# EasyEDA Pro project ProPrj_STM32F407核心板M.2_Vel1.0.epro, board PCB1
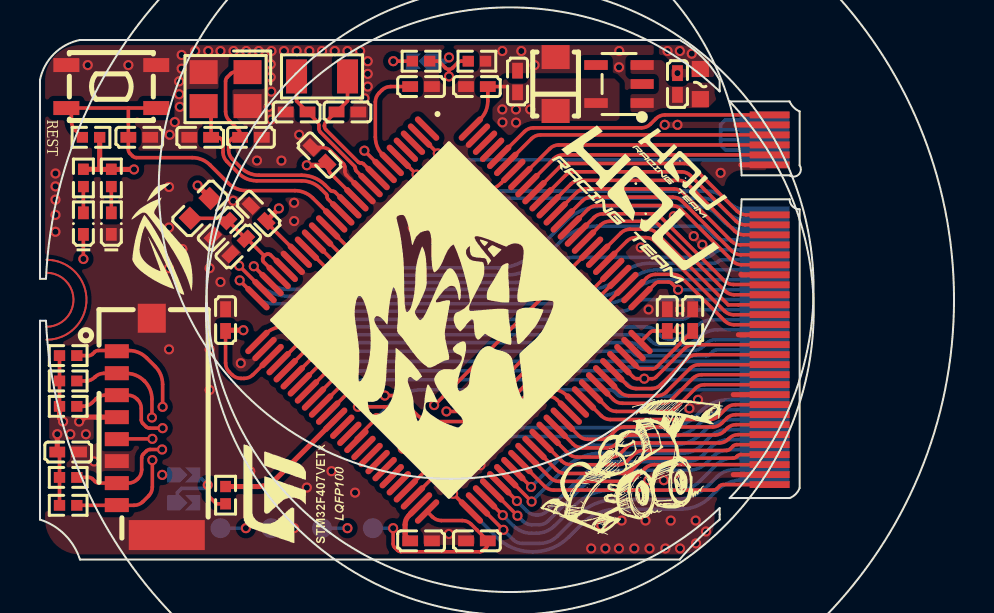
[diagram p1: board, top side]
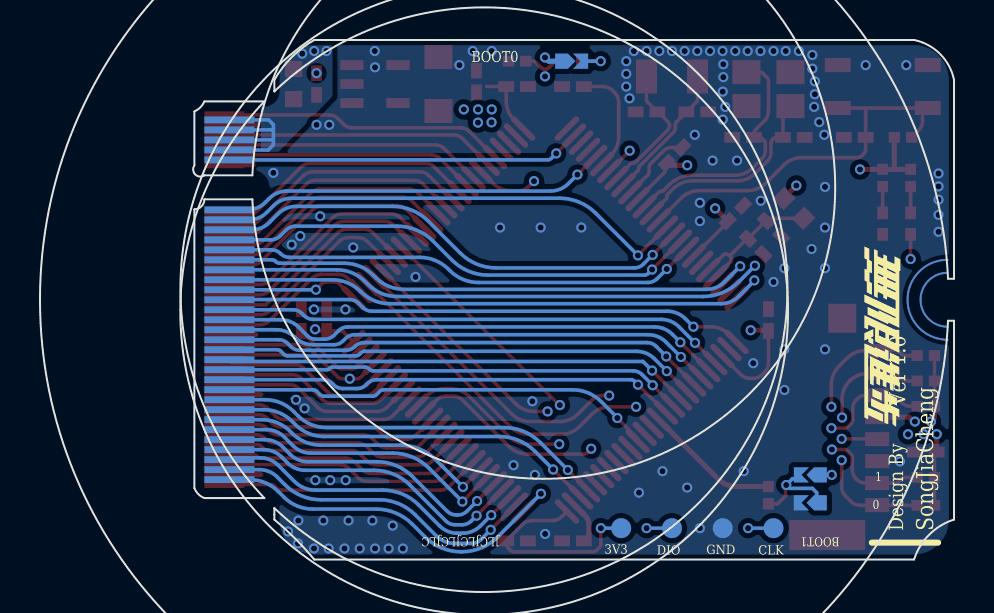
[diagram p2: board, bottom side, seen from below]

Outline 38 x 26 mm; copper layers: Top Layer, Inner1, Inner2, Bottom Layer. Coordinates in mm from the lower left corner of the outline.
Stack: Top Layer 0.035mm 外层铜厚1oz / Dielectric1 0.2104mm 7628 RC49% 8.6mil / Inner1 0.0152mm 内层铜厚 / Dielectric2 1.065mm 1.1mm H/HOZ Copper / Inner2 0.0152mm 内层铜厚 / Dielectric3 0.2104mm 7628 RC49% 8.6mil / Bottom Layer 0.035mm 外层铜厚1oz

## Design rules (mm)
template: 自定义配置
spacing copperThickness1oz (default): track to track 0.102, other pairs 0.152 to 0.3
spacing copperThickness2oz: track to track 0.203, other pairs 0.152 to 0.3
track width copperThickness1oz (default): min 0.127, default 0.152, max 2.54
track width copperThickness2oz: min 0.203, default 0.254, max 2.54
differential pair differentialPair (default): width min 0.127, default 0.254, max 2.54; gap min 0.152, default 0.152
via viaSize (default): diameter min 0.5, default 0.61, max 10; hole min 0.3, default 0.305, max 6.299

## Placement (name value [footprint] x y rotation side)
3V3  -  [Test-Point-0.5mm]  16.65 1.57 180 bottom
C1  100nF  [C0402]  9.28 11.98 90 top
C2  100nF  [C0402]  13.98 20.24 135 top
C3  100nF  [C0402]  10.94 17.32 135 top
C4  100nF  [C0402]  9.92 15.67 45 top
C6  100nF  [C0402]  4.97 21.13 0 top
C7  10pF  [C0402]  15.38 22.4 180 top
C8  10pF  [C0402]  12.84 22.4 0 top
C12  100nF  [C0402]  21.86 23.67 180 top
C13  100nF  [C0402]  31.38 11.98 90 top
C14  100nF  [C0402]  21.86 0.94 180 top
C15  10uF  [C0402]  9.03 16.56 45 top
C16  22pF  [C0402]  10.55 21.13 180 top
C17  22pF  [C0402]  8.01 21.13 0 top
C21  2.2uF  [C0402]  19.06 0.94 0 top
C22  2.2uF  [C0402]  32.65 11.98 90 top
C23  100nF  [C0402]  19.06 23.67 180 top
C24  100nF  [C0402]  1.41 5.38 180 top
C25  100nF  [C0402]  31.89 23.8 270 top
C26  100nF  [C0402]  23.89 23.92 270 top
C27  10uF  [CAP-SMD_L3.2-W1.6]  25.79 23.8 90 top
CARD1  TF-021B-H265  [TF-SMD_TF-021B-H265]  5.09 6.65 90 top
CLK  -  [Test-Point-0.5mm]  9.03 1.57 180 bottom
DIO  -  [Test-Point-0.5mm]  14.11 1.57 180 bottom
F1  BSMD0603-050-6V  [F0603]  33.03 23.8 270 top
GND  -  [Test-Point-0.5mm]  11.57 1.57 180 bottom
J1  -  [M.2.BKey.MALE.2230]  23 13 90 top
L1  CBG160808U121T  [L0603]  8.01 17.57 45 top
LED1  NCD0402G1  [LED0402-RD]  3.57 16.81 90 top
LED2  NCD0402G1  [LED0402-RD]  2.17 16.81 90 top
R2  10kΩ  [R0402]  2.55 21.13 0 top
R15  360Ω  [R0402]  19.06 24.94 180 top
R16  1.5kΩ  [R0402]  21.86 24.94 180 top
R18  1.5kΩ  [R0402]  9.28 3.22 270 top
R19  3kΩ  [R0402]  3.57 19.1 270 top
R20  360Ω  [R0402]  2.17 19.1 90 top
R21  10kΩ  [R0402]  1.41 4.11 180 top
R22  10kΩ  [R0402]  1.41 2.71 180 top
R23  10kΩ  [R0402]  1.41 10.21 180 top
R24  10kΩ  [R0402]  1.41 8.94 180 top
R25  10kΩ  [R0402]  1.41 7.67 180 top
SW1  TS-1089S-02526  [SW-SMD_4P-L4.2-W3.3-P2.15-LS5.1]  3.57 23.67 180 top
U11  STM32F407VET6  [LQFP-100_L14.0-W14.0-P0.50-LS16.0-BL]  20.46 11.98 225 top
U12  -  [JP_W1.6_H0.8]  19.95 24.56 180 bottom
U13  -  [JP_W1.6_H0.8]  6.36 4.62 0 bottom
U14  -  [JP_W1.6_H0.8]  6.36 3.22 0 bottom
U65  RT9013-33GB  [SOT-23-5_L3.0-W1.7-P0.95-LS2.8-BL]  28.97 23.8 90 top
X1  8MHz  [CRYSTAL-SMD_4P-L3.2-W2.5-BL]  9.28 23.54 180 top
X2  32.768kHz  [CRYSTAL-SMD_L3.2-W1.5-1]  14.11 24.18 180 top

## Footprints (pads in the part's own frame, mm; a bottom-side part is the same pattern mirrored in y, then rotated)
C0402
  rect 0.79x0.54 smd: 1(-0.545,0) 2(0.545,0)
CAP-SMD_L3.2-W1.6
  rect 1.2x1.4 smd: 1(-1.35,0) 2(1.35,0)
CRYSTAL-SMD_4P-L3.2-W2.5-BL
  rect 1.4x1.2 smd: 1(-1.1,-0.85) 2(1.1,-0.85) 3(1.1,0.85) 4(-1.1,0.85)
CRYSTAL-SMD_L3.2-W1.5-1
  rect 1.05x1.7 smd: 1(-1.275,0) 2(1.275,0)
F0603
  rect 0.806x0.864 smd: 1(-0.753,0) 2(0.753,0)
JP_W1.6_H0.8
  custom 1.016x0.762 smd: 1(0.508,0.381)
  custom 0.762x0.762 smd: 2(1.27,0.572)
  custom 0x0 smd: 4(1.232,-0.038)
L0603
  rect 0.8x0.864 smd: 1(-0.7,0) 2(0.7,0)
LED0402-RD
  rect 0.636x0.54 smd: 1(-0.538,0) 2(0.538,0)
LQFP-100_L14.0-W14.0-P0.50-LS16.0-BL
  oval 0.3x1.6 smd: 1(-6,-7.55) 2(-5.5,-7.55) 3(-5,-7.55) 4(-4.5,-7.55) 5(-4,-7.55) 6(-3.5,-7.55) 7(-3,-7.55) 8(-2.5,-7.55) 9(-2,-7.55) 10(-1.5,-7.55) 11(-1,-7.55) 12(-0.5,-7.55) 13(0,-7.55) 14(0.5,-7.55) 15(1,-7.55) 16(1.5,-7.55) 17(2,-7.55) 18(2.5,-7.55) 19(3,-7.55) 20(3.5,-7.55) 21(4,-7.55) 22(4.5,-7.55) 23(5,-7.55) 24(5.5,-7.55) 25(6,-7.55) 51(6,7.55) 52(5.5,7.55) 53(5,7.55) 54(4.5,7.55) 55(4,7.55) 56(3.5,7.55) 57(3,7.55) 58(2.5,7.55) 59(2,7.55) 60(1.5,7.55) 61(1,7.55) 62(0.5,7.55) 63(0,7.55) 64(-0.5,7.55) 65(-1,7.55) 66(-1.5,7.55) 67(-2,7.55) 68(-2.5,7.55) 69(-3,7.55) 70(-3.5,7.55) 71(-4,7.55) 72(-4.5,7.55) 73(-5,7.55) 74(-5.5,7.55) 75(-6,7.55)
  oval 1.6x0.3 smd: 26(7.55,-6) 27(7.55,-5.5) 28(7.55,-5) 29(7.55,-4.5) 30(7.55,-4) 31(7.55,-3.5) 32(7.55,-3) 33(7.55,-2.5) 34(7.55,-2) 35(7.55,-1.5) 36(7.55,-1) 37(7.55,-0.5) 38(7.55,0) 39(7.55,0.5) 40(7.55,1) 41(7.55,1.5) 42(7.55,2) 43(7.55,2.5) 44(7.55,3) 45(7.55,3.5) 46(7.55,4) 47(7.55,4.5) 48(7.55,5) 49(7.55,5.5) 50(7.55,6) 76(-7.55,6) 77(-7.55,5.5) 78(-7.55,5) 79(-7.55,4.5) 80(-7.55,4) 81(-7.55,3.5) 82(-7.55,3) 83(-7.55,2.5) 84(-7.55,2) 85(-7.55,1.5) 86(-7.55,1) 87(-7.55,0.5) 88(-7.55,0) 89(-7.55,-0.5) 90(-7.55,-1) 91(-7.55,-1.5) 92(-7.55,-2) 93(-7.55,-2.5) 94(-7.55,-3) 95(-7.55,-3.5) 96(-7.55,-4) 97(-7.55,-4.5) 98(-7.55,-5) 99(-7.55,-5.5) 100(-7.55,-6)
M.2.BKey.MALE.2230
  custom 0.34x2 smd: 1(9.25,-13.5) 3(8.75,-13.5) 5(8.25,-13.5) 7(7.75,-13.5) 9(7.25,-13.5) 11(6.75,-13.5) 21(4.25,-13.5) 23(3.75,-13.5) 25(3.25,-13.5) 27(2.75,-13.5) 29(2.25,-13.5) 31(1.75,-13.5) 33(1.25,-13.5) 35(0.75,-13.5) 37(0.25,-13.5) 39(-0.25,-13.5) 41(-0.75,-13.5) 43(-1.25,-13.5) 45(-1.75,-13.5) 47(-2.25,-13.5) 49(-2.75,-13.5) 51(-3.25,-13.5) 53(-3.75,-13.5) 55(-4.25,-13.5) 57(-4.75,-13.5) 59(-5.25,-13.5) 61(-5.75,-13.5) 63(-6.25,-13.5) 65(-6.75,-13.5) 67(-7.25,-13.5) 69(-7.75,-13.5) 71(-8.25,-13.5) 73(-8.75,-13.5) 75(-9.25,-13.5)
  custom 0.34x2.5 smd far side: 2(9,-13.25) 4(8.5,-13.25) 6(8,-13.25) 8(7.5,-13.25) 10(7,-13.25) 20(4.5,-13.25) 22(4,-13.25) 24(3.5,-13.25) 26(3,-13.25) 28(2.5,-13.25) 30(2,-13.25) 32(1.5,-13.25) 34(1,-13.25) 36(0.5,-13.25) 38(0,-13.25) 40(-0.5,-13.25) 42(-1,-13.25) 44(-1.5,-13.25) 46(-2,-13.25) 48(-2.5,-13.25) 50(-3,-13.25) 52(-3.5,-13.25) 54(-4,-13.25) 56(-4.5,-13.25) 58(-5,-13.25) 60(-5.5,-13.25) 62(-6,-13.25) 64(-6.5,-13.25) 66(-7,-13.25) 68(-7.5,-13.25) 70(-8,-13.25) 72(-8.5,-13.25) 74(-9,-13.25)
  custom 4x2.001 smd: 76(0,21)
  custom 4x2.001 smd far side: 77(0,21)
R0402
  rect 0.566x0.54 smd: 1(-0.433,0) 2(0.433,0)
SOT-23-5_L3.0-W1.7-P0.95-LS2.8-BL
  rect 0.49x1.157 smd: 1(-0.95,-1.153) 2(0,-1.153) 3(0.95,-1.153)
  rect 0.49x1.175 smd: 4(0.95,1.153) 5(-0.95,1.153)
SW-SMD_4P-L4.2-W3.3-P2.15-LS5.1
  rect 1.3x0.7 smd: 1(-2.25,1.075) 2(2.25,1.075) 3(-2.25,-1.075) 4(2.25,-1.075)
Test-Point-0.5mm
  round 1 smd: 1(0,0)
TF-SMD_TF-021B-H265
  rect 0.7x1.2 smd: 1(3.775,1.25) 2(2.675,1.25) 3(1.575,1.25) 4(0.475,1.25) 5(-0.625,1.25) 6(-1.725,1.25) 7(-2.825,1.25) 8(-3.925,1.25)
  rect 1.5x3.8 smd: 9(-5.425,-1.25)
  rect 1.45x1.4 smd: 10(5.425,-0.5)

## Nets
As in the schematic.

Pads without a net: J1 76 77; U11 1 3 4 38 39 41 42 43 44 45 46 97 98; U12 4; U13 4; U14 4; U65 4

## Via types
v1: diameter 0.508, hole 0.305, Top Layer to Bottom Layer, 173 vias

## Routing (per net, layer and track width the routed paths; a pad name or vN(x,y) marks a point on that pad's centre or on a via; arc(x,y) is an arc through that point)
3V3: length 142.6
  Top Layer w0.178: 23.38,23.67 C12.1 22.4,22.94 arc(22.31,22.45) 22.03,22.04 21.56,21.56 ; v1(31.96,11.52) 31.88,11.44 C13.1 30.7,11.44 arc(30.6,11.42) 30.52,11.36 30.04,10.89 ; C1.1 9.28,9.83 arc(9.33,9.59) 9.47,9.39 9.61,9.25 arc(9.81,9.11) 10.06,9.06 10.21,9.06 arc(10.45,9.11) 10.65,9.25 U11.28 ; U11.19 11.32,16.88 C3.1 ; C24.2 0.98,5.27 R21.2 R22.2 ; 21.85,1.49 21.85,1.49 ; 21.85,1.49 C14.1 22.4,0.78 arc(22.38,0.69) 22.33,0.61 22.19,0.46 arc(22.1,0.41) 22.01,0.39 18.06,0.39 arc(17.97,0.41) 17.88,0.46 17.74,0.61 arc(17.69,0.69) 17.67,0.79 v1(17.67,1.57) ; 21.85,1.49 21.57,1.77 arc(21.37,1.9) 21.12,1.95 20.08,1.95 arc(19.84,2) 19.63,2.14 19.36,2.4 ; R25.2 R24.2 R23.2 ; 14.43,19.71 14.43,19.53 arc(14.45,19.43) 14.51,19.35 U11.11
  Top Layer w0.254: CARD1.4 2.25,7.12 2.03,6.9 v1(1.96,6.9) ; 8.51,18.07 8.51,18.09 v1(7.89,18.72) ; v1(0.87,6.27) C24.2 ; 2.97,19.52 2.7,19.52 2.7,19.53 2.17,19.53 ; 2.97,19.52 v1(4.7,19.52) ; 2.97,19.52 2.99,19.54 R2.2 ; v1(1.16,6.9) 0.98,7.08 R25.2 ; v1(13.35,19.73) 14.25,19.73 C2.1 ; C3.1 11.32,16.94 v1(11.95,17.57) ; C1.1 9.32,11.48 v1(10.17,11.48)
  Inner1 w0.178: v1(6.12,4.24) 6.12,0.56 6.12,0.55
  Inner1 w0.254: v1(31.96,11.52) 24.98,11.52 22.87,13.64 ; 7.81,12.75 7.89,12.83 v1(7.89,18.72) ; v1(13.35,19.73) 13.35,13.13 ; v1(11.95,17.57) 11.95,13.13 ; v1(10.17,11.48) 10.17,12.49 ; v1(4.7,19.52) 4.7,13.13 ; v1(23.13,22.53) 23.06,22.53 v1(20.46,25.13)
  Inner1 w0.305: v1(17.67,1.57) 17.67,0.94 17.28,0.55 2.83,0.55 arc(2.34,0.65) 1.93,0.93 1.78,1.07 arc(1.51,1.48) 1.41,1.97 1.41,6.17 v1(1.52,6.27)
  Inner1 w0.508: v1(1.96,6.9) 3.59,8.53 arc(4.14,9.36) 4.33,10.33 4.33,12.11 arc(4.52,12.56) 4.97,12.75
  Inner1 w1.27: v1(23.81,22.53) 23.81,16.01 arc(23.62,15.03) 23.07,14.21 22.35,13.49 arc(21.52,12.94) 20.55,12.75 4.97,12.75
  Bottom Layer w0.178: v1(6.12,4.24) U13.1 ; v1(17.67,1.57) 3V3.1
  Bottom Layer w0.254: v1(20.46,25.13) 20.27,24.94 U12.1
  vias: v1(2.3,6.27) v1(23.14,21.88) v1(23.81,21.86) v1(24.52,22.53)
GND: length 13.5
  Top Layer w0.178: U11.10 15.33,19.24 arc(15.27,19.32) 15.25,19.42 15.25,19.63 arc(15.23,19.72) 15.18,19.81 14.55,20.44 arc(14.34,20.58) 14.1,20.62 C2.2
  Top Layer w0.254: J1.33 35.09,14.25 35.06,14.27 ; J1.11 35.06,19.75 ; J1.3 34.81,21.75 ; J1.45 34.94,11.25 ; J1.73 34.68,4.25 ; J1.57 34.68,8.25
  vias: v1(0.78,19.32) v1(0.78,18.67) v1(0.78,18.01) v1(0.78,17.25) v1(0.78,16.4) v1(2.39,24.74) v1(2.71,4.91) v1(4.42,24.74) v1(6.49,21.25) v1(6.45,18.65) v1(6.45,16.61) v1(6.45,14.58) v1(6.45,10.52) v1(6.74,21.89) v1(6.96,23.93) v1(6.96,23.28) v1(7,22.65) v1(7.09,25.25) v1(7.09,24.56) v1(7.12,15.54) v1(7.76,25.45) v1(8.42,25.45) v1(8.49,14.58) v1(8.49,10.52) v1(8.49,8.49) v1(9.03,25.45) v1(9.03,13.89) v1(9.68,25.45) v1(9.67,17.95) v1(10.05,9.83) v1(10.32,25.45) v1(10.52,4.42) v1(10.85,19.96) v1(10.94,25.45) v1(11.44,22.65) v1(11.58,25.45) v1(11.54,24.78) v1(11.54,24.14) v1(11.57,23.41) v1(11.57,22.02) v1(12.08,19.96) v1(12.21,25.45) v1(12.71,17.85) v1(12.71,16.94) v1(12.71,1.57) v1(12.84,25.45) v1(12.97,21.25) v1(13.35,3.6) v1(13.47,25.45) v1(14.11,25.45) v1(14.58,4.42) v1(14.75,25.45) v1(15.38,25.45) v1(15.76,3.35) v1(16.02,25.45) v1(16.23,23.08) v1(16.4,24.94) v1(16.4,24.3) v1(16.4,23.67) v1(18.65,16.61) v1(20.46,1.28) v1(20.68,16.61) v1(20.97,4.24) v1(21.09,7.92) v1(22.03,4.72) v1(22.71,16.61) v1(23.13,25.45) v1(24.08,25.45) v1(24.74,24.74) v1(26.94,14.14) v1(27.57,0.55) v1(28.08,1.7) v1(28.28,0.55) v1(28.98,25.45) v1(28.97,24.63) v1(28.96,0.55) v1(29.1,1.95) v1(29.73,0.55) v1(30.05,15.62) v1(30.29,1.95) v1(30.44,12.51) v1(30.43,3.97) v1(30.49,0.55) v1(31.21,3.97) v1(31.25,21.75) v1(31.29,0.55) v1(31.55,1.95) v1(31.71,17.18) v1(31.89,24.34) v1(31.89,21.75) v1(31.95,3.97) v1(32.02,12.51) v1(32.02,0.55) v1(32.49,7.56) v1(32.7,16.18) v1(32.8,1.95) v1(32.82,0.81) v1(32.92,7.99) v1(33.13,15.75) v1(33.32,1.4) v1(34.05,19.35)
VDDA: length 7.2
  Top Layer w0.178: 10.34,16.05 10.36,16.05 11.2,15.22 ; 7.52,17.08 9.23,17.08 arc(9.28,17.07) 9.32,17.04 C15.2 C4.2 ; U11.21 12.28,14.49 11.53,15.25 arc(11.49,15.27) 11.44,15.28 11.37,15.28 arc(11.32,15.28) 11.28,15.25 11.18,15.15 arc(11.15,15.11) 11.14,15.06 11.14,14.99 arc(11.15,14.94) 11.18,14.9 U11.22
BOOT0: length 11.1
  Top Layer w0.178: 20.46,24.42 v1(20.46,24.18) ; R15.1 19.84,24.94 arc(19.94,24.92) 20.02,24.86 20.28,24.6 arc(20.46,24.53) 20.64,24.6 20.9,24.86 arc(20.98,24.92) 21.08,24.94 R16.2 ; v1(21.01,18.94) 21.3,18.65 arc(21.51,18.51) 21.75,18.46 22.17,18.46 arc(22.65,18.56) 23.07,18.83 U11.94
  Inner1 w0.178: v1(20.46,24.18) 20.46,19.48 v1(21.01,18.94)
BOOT1: length 6.8
  Top Layer w0.254: 14.77,7 11.8,4.03 arc(11.38,3.75) 10.9,3.65 R18.1
M2_IN_+5V: length 10.1
  Bottom Layer w0.178: 34.05,21.55 34.1,21.5 J1.4 ; 34.05,21.55 34.05,21.02 ; 34.05,21.55 34.05,21.76 34.29,22 J1.2 ; J1.8 36.24,20.49 34.3,20.49 34.05,20.75 34.05,21.02 ; 34.05,21.02 34.07,21 J1.6
  vias: v1(31.39,25.45) v1(32.01,25.45) v1(32.6,25.31)
NRST: length 19.9
  Top Layer w0.178: R2.1 1.76,21.49 arc(1.62,21.69) 1.57,21.94 1.57,22.59 4.42,22.59 ; 4.42,22.59 C6.1 4.42,20.51 arc(4.44,20.41) 4.5,20.33 4.64,20.19 arc(4.72,20.13) 4.82,20.11 7.62,20.11 arc(8.1,20.02) 8.51,19.74 9.42,18.83 arc(9.83,18.56) 10.32,18.46 12.75,18.46 arc(13.24,18.36) 13.65,18.09 14.77,16.97 ; 4.42,22.59 6.07,22.59
OSC32_IN: length 6.7
  Top Layer w0.178: U11.8 16.17,19.81 arc(16.13,19.83) 16.08,19.84 16.02,19.84 arc(15.97,19.85) 15.93,19.88 14.31,21.51 arc(14.25,21.59) 14.23,21.69 14.23,21.72 arc(14.25,21.82) 14.31,21.9 14.8,22.4 C7.2 15.39,22.95 X2.1
OSC32_OUT: length 6.9
  Top Layer w0.178: X2.2 12.84,22.95 C8.2 13.88,21.91 arc(13.93,21.82) 13.95,21.73 13.95,21.57 arc(13.97,21.47) 14.03,21.39 15.74,19.68 arc(15.77,19.64) 15.78,19.59 15.78,19.55 arc(15.79,19.5) 15.82,19.46 U11.9
OSC_IN: length 12.7
  Top Layer w0.178: 10.38,24.39 9.73,24.39 arc(9.63,24.37) 9.55,24.32 9.36,24.12 arc(9.3,24.04) 9.28,23.94 9.28,22.41 arc(9.33,22.17) 9.47,21.96 9.93,21.5 arc(9.99,21.42) 10.01,21.32 C16.2 9.77,21.13 arc(9.67,21.11) 9.59,21.05 9.51,20.97 arc(9.46,20.89) 9.44,20.79 9.44,20.49 arc(9.48,20.25) 9.62,20.04 10.06,19.6 arc(10.47,19.33) 10.96,19.23 13.09,19.23 arc(13.72,19.11) 14.25,18.75 14.54,18.46 arc(14.58,18.44) 14.63,18.43 14.67,18.43 arc(14.72,18.42) 14.76,18.39 15.47,17.68
OSC_OUT: length 10.2
  Top Layer w0.178: U11.13 14.4,18.04 arc(14.38,18.08) 14.37,18.13 14.37,18.19 arc(14.36,18.23) 14.33,18.28 14.06,18.55 arc(13.61,18.85) 13.08,18.95 10.84,18.95 arc(10.36,19.05) 9.95,19.32 9.34,19.93 arc(9.21,20.13) 9.16,20.38 9.16,20.84 arc(9.14,20.94) 9.08,21.02 9.05,21.05 arc(8.97,21.11) 8.87,21.13 8.69,21.13 arc(8.6,21.17) 8.56,21.25 8.56,22.05 arc(8.51,22.3) 8.37,22.5 X1.3
PA0: length 27.7
  Top Layer w0.178: v1(10.7,14.68) U11.23
  Bottom Layer w0.178: v1(10.7,14.68) 11.48,13.89 arc(11.89,13.62) 12.38,13.52 27.5,13.52 arc(28.28,13.67) 28.94,14.12 29.06,14.23 arc(29.72,14.67) 30.5,14.83 33.74,14.83 arc(33.84,14.85) 33.92,14.9 33.94,14.93 arc(34.02,14.98) 34.12,15 J1.30
PA1: length 29
  Top Layer w0.178: v1(9.96,14.7) U11.24
  Bottom Layer w0.178: 36.25,14.5 30.89,14.5 arc(30.11,14.35) 29.45,13.91 29.3,13.76 arc(28.64,13.32) 27.87,13.16 12.56,13.16 arc(11.58,13.36) 10.76,13.91 v1(9.96,14.7)
PA2: length 28.3
  Top Layer w0.178: 10.88,13.08 v1(9.99,13.97)
  Bottom Layer w0.178: v1(9.99,13.97) 9.99,13.94 10.76,13.17 arc(11.17,12.9) 11.66,12.8 28.23,12.8 arc(29.01,12.96) 29.67,13.4 29.68,13.41 arc(30.33,13.85) 31.11,14 J1.34
PA3: length 26.1
  Top Layer w0.178: v1(13.04,11.65) 12.17,11.65 arc(11.68,11.55) 11.27,11.28 10.88,10.89
  Bottom Layer w0.178: v1(13.04,11.65) 13.44,12.05 arc(13.85,12.33) 14.34,12.43 29.12,12.43 arc(29.37,12.47) 29.57,12.61 29.78,12.82 arc(29.99,12.96) 30.23,13.01 36.24,13.01 J1.38
PA4: length 25.3
  Top Layer w0.178: v1(12.96,10.84) U11.29
  Bottom Layer w0.178: v1(12.96,10.84) 13.76,11.65 arc(14.17,11.92) 14.66,12.02 32.06,12.02 arc(32.31,12.07) 32.51,12.2 32.62,12.31 arc(32.83,12.45) 33.07,12.5 J1.40
PA5: length 25.3
  Top Layer w0.178: v1(13.69,10.87) U11.30
  Bottom Layer w0.178: J1.42 33.68,12 arc(33.19,11.9) 32.78,11.63 32.34,11.18 arc(32.16,11.07) 31.96,11.03 31.47,11.03 arc(31.23,11.08) 31.02,11.21 30.78,11.45 arc(30.58,11.59) 30.33,11.64 14.99,11.64 arc(14.5,11.54) 14.09,11.27 v1(13.69,10.87)
PA6: length 24.8
  Top Layer w0.178: v1(13.66,10.14) U11.31
  Bottom Layer w0.178: v1(13.66,10.14) 14.41,10.88 arc(14.82,11.16) 15.3,11.25 29.99,11.25 arc(30.23,11.2) 30.44,11.07 30.57,10.94 arc(30.77,10.8) 31.02,10.75 32.08,10.75 arc(32.56,10.85) 32.98,11.12 32.98,11.13 arc(33.39,11.4) 33.88,11.5 J1.44
PA7: length 24.4
  Top Layer w0.178: v1(14.4,10.16) U11.32
  Bottom Layer w0.178: v1(14.4,10.16) 14.9,10.67 arc(15.11,10.81) 15.35,10.86 29.51,10.86 arc(29.76,10.81) 29.96,10.67 29.98,10.66 arc(30.18,10.52) 30.43,10.47 32.72,10.47 arc(32.97,10.52) 33.17,10.66 33.33,10.81 arc(33.54,10.95) 33.78,11 J1.46
PA8: length 9.9
  Top Layer w0.178: J1.59 34.78,7.75 arc(34.53,7.7) 34.33,7.56 33.96,7.19 arc(33.75,7.05) 33.51,7.01 28.53,7.01 arc(28.29,7.05) 28.08,7.19 U11.67
PA9: length 9.8
  Top Layer w0.178: J1.55 33.24,8.75 arc(32.99,8.7) 32.79,8.56 31.82,7.6 arc(31.62,7.46) 31.37,7.41 28.83,7.41 arc(28.59,7.46) 28.38,7.6 U11.68
PA10: length 9.5
  Top Layer w0.178: J1.53 33.1,9.25 arc(32.86,9.2) 32.65,9.06 31.59,8 arc(31.39,7.87) 31.14,7.82 29.13,7.82 arc(28.89,7.87) 28.68,8 U11.69
PA11: length 9.2
  Top Layer w0.178: U11.70 29.01,8.39 arc(29.21,8.25) 29.46,8.2 30.89,8.2 arc(31.13,8.25) 31.34,8.39 32.52,9.56 arc(32.72,9.7) 32.97,9.75 J1.51
PA12: length 8.9
  Top Layer w0.178: U11.71 29.36,8.74 arc(29.57,8.6) 29.81,8.56 30.61,8.56 arc(30.85,8.6) 31.06,8.74 32.38,10.06 arc(32.59,10.2) 32.83,10.25 J1.49
PA13: length 27.8
  Top Layer w0.178: J1.47 32.7,10.75 arc(32.45,10.7) 32.25,10.56 30.81,9.12 arc(30.73,9.07) 30.63,9.05 v1(30.23,9.05) 29.86,9.05 arc(29.77,9.07) 29.68,9.12 U11.72
  Inner1 w0.178: v1(30.23,9.05) 28.86,9.05 arc(28.38,8.95) 27.96,8.68 22.55,3.26 arc(21.72,2.71) 20.75,2.52 16.08,2.52 arc(15.84,2.47) 15.63,2.33 15.45,2.15 arc(15.4,2.07) 15.38,1.97 v1(15.38,1.57)
  Bottom Layer w0.178: v1(15.38,1.57) DIO.1
PA14: length 36.9
  Top Layer w0.178: v1(31.92,13.5) 31.61,13.81 arc(31.53,13.87) 31.43,13.89 30.96,13.89 arc(30.86,13.87) 30.78,13.81 30.04,13.08
  Inner1 w0.178: v1(31.92,13.5) 32.41,13.02 arc(32.68,12.61) 32.78,12.12 32.78,11.88 arc(32.68,11.39) 32.41,10.98 31.75,10.31 arc(30.92,9.76) 29.95,9.57 29.37,9.57 arc(28.53,9.4) 27.82,8.93 22.43,3.54 arc(21.61,2.99) 20.63,2.8 11.18,2.8 arc(10.94,2.75) 10.73,2.61 10.49,2.37 arc(10.35,2.16) 10.3,1.92 v1(10.3,1.57)
  Bottom Layer w0.178: J1.36 31.93,13.5 v1(31.92,13.5) ; v1(10.3,1.57) CLK.1
PA15: length 8.1
  Top Layer w0.178: J1.43 34.71,11.75 arc(34.47,11.8) 34.26,11.94 32.11,14.08 arc(31.91,14.22) 31.67,14.27 30.79,14.27 arc(30.54,14.22) 30.34,14.08 U11.77
PB0: length 23
  Top Layer w0.178: v1(15.08,8.72) U11.35
  Bottom Layer w0.178: J1.52 31.35,9.5 arc(31.3,9.51) 31.26,9.54 31.21,9.59 arc(31.17,9.62) 31.12,9.63 29.46,9.63 arc(29.36,9.61) 29.28,9.55 29.24,9.52 arc(29.16,9.46) 29.06,9.44 16.06,9.44 arc(15.81,9.4) 15.61,9.26 15.08,8.73 v1(15.08,8.72)
PB1: length 22.8
  Top Layer w0.178: v1(15.81,8.75) U11.36
  Bottom Layer w0.178: J1.54 31.55,9 arc(31.31,8.95) 31.1,8.81 31.03,8.74 arc(30.82,8.6) 30.58,8.56 29.87,8.56 arc(29.62,8.6) 29.42,8.74 29.34,8.81 arc(29.14,8.95) 28.9,9 16.17,9 arc(16.07,8.98) 15.99,8.93 v1(15.81,8.75)
PB3: length 12.6
  Top Layer w0.178: 25.45,17.68 26.56,18.79 arc(26.76,18.93) 27.01,18.97 31.95,18.97 arc(32.2,18.93) 32.4,18.79 34.75,16.44 arc(34.96,16.3) 35.2,16.25 J1.25
PB4: length 13
  Top Layer w0.178: J1.23 35.27,16.75 arc(35.03,16.8) 34.82,16.94 32.54,19.22 arc(32.33,19.35) 32.09,19.4 26.73,19.4 arc(26.48,19.35) 26.28,19.22 U11.90
PB5: length 13.3
  Top Layer w0.178: J1.21 35.32,17.25 arc(35.08,17.3) 34.87,17.44 32.67,19.63 arc(32.47,19.77) 32.22,19.82 26.44,19.82 arc(26.19,19.77) 25.99,19.63 U11.91
PB6: length 12.7
  Top Layer w0.178: U11.92 25.71,20.06 arc(25.92,20.2) 26.16,20.25 J1.9
PB7: length 13.1
  Top Layer w0.178: J1.7 36.5,20.75 25.95,20.75 arc(25.71,20.7) 25.5,20.56 U11.93
PB8: length 13.8
  Top Layer w0.178: J1.5 25.04,21.25 arc(24.8,21.2) 24.59,21.06 U11.95
PB9: length 14.3
  Top Layer w0.178: J1.1 31.27,22.25 arc(31.02,22.2) 30.82,22.06 30.54,21.79 arc(30.34,21.65) 30.09,21.6 24.69,21.6 arc(24.44,21.56) 24.24,21.42 U11.96
PB10: length 19.5
  Top Layer w0.178: v1(19.32,4.48) U11.47
  Bottom Layer w0.178: v1(19.32,4.48) 20.7,5.86 arc(21.52,6.41) 22.5,6.6 31.39,6.6 arc(32.16,6.76) 32.82,7.2 33.03,7.41 arc(33.69,7.85) 34.47,8 J1.58
PB11: length 19.1
  Top Layer w0.178: v1(20.05,4.51) U11.48
  Bottom Layer w0.178: J1.60 34.54,7.5 arc(33.76,7.35) 33.1,6.91 32.95,6.75 arc(32.29,6.31) 31.51,6.16 22.76,6.16 arc(21.78,5.96) 20.96,5.41 v1(20.05,4.51)
PB12: length 19
  Top Layer w0.178: v1(20.67,3.29) 21.56,2.4
  Bottom Layer w0.178: J1.74 35.24,4 arc(34.46,3.85) 33.8,3.41 33.52,3.12 arc(32.86,2.68) 32.08,2.52 28.91,2.52 arc(27.93,2.33) 27.11,1.78 26.46,1.13 arc(25.64,0.58) 24.67,0.39 24.62,0.39 arc(23.65,0.58) 22.83,1.13 v1(20.67,3.29)
PB13: length 16.3
  Top Layer w0.178: v1(23.18,1.49) U11.52
  Bottom Layer w0.178: J1.72 34.75,4.5 arc(34.27,4.4) 33.85,4.13 33.46,3.74 arc(32.64,3.19) 31.67,2.99 28.76,2.99 arc(27.79,2.8) 26.96,2.25 25.9,1.18 arc(25.48,0.9) 25,0.81 24.12,0.81 arc(23.88,0.86) 23.67,0.99 v1(23.18,1.49)
PB14: length 16
  Top Layer w0.178: v1(23.15,2.22) U11.53
  Bottom Layer w0.178: v1(23.15,2.22) 23.69,1.69 arc(24.1,1.41) 24.58,1.32 24.84,1.32 arc(25.33,1.41) 25.74,1.69 26.78,2.73 arc(27.6,3.28) 28.58,3.47 31.95,3.47 arc(32.52,3.59) 33,3.91 33.8,4.72 arc(34.22,4.99) 34.7,5.09 36.11,5.09 arc(36.16,5.08) 36.2,5.05 J1.70
PB15: length 15.6
  Top Layer w0.178: v1(23.89,2.19) U11.54
  Bottom Layer w0.178: v1(23.89,2.19) 24.15,1.93 arc(24.36,1.79) 24.6,1.74 24.97,1.74 arc(25.21,1.79) 25.42,1.93 27.21,3.72 arc(28.03,4.27) 29.01,4.47 32.45,4.47 arc(32.93,4.56) 33.34,4.84 33.63,5.13 arc(34.05,5.4) 34.53,5.5 J1.68
PC0: length 23.8
  Top Layer w0.178: v1(15.81,15.22) U11.15
  Bottom Layer w0.178: v1(15.81,15.22) 17.93,17.34 arc(18.75,17.89) 19.72,18.08 33.14,18.08 arc(33.63,17.98) 34.04,17.71 34.38,17.37 arc(34.79,17.1) 35.27,17 J1.22
PC1: length 24.3
  Top Layer w0.178: v1(15.08,15.25) U11.16
  Bottom Layer w0.178: v1(15.08,15.25) 15.54,14.78 arc(15.75,14.64) 15.99,14.59 22.91,14.59 arc(23.88,14.79) 24.7,15.34 26.29,16.93 arc(27.12,17.48) 28.09,17.67 32.91,17.67 arc(33.4,17.58) 33.81,17.3 34.24,16.87 arc(34.65,16.6) 35.14,16.5 J1.24
PC2: length 24.3
  Top Layer w0.178: U11.17 v1(15.1,14.51)
  Bottom Layer w0.178: J1.26 34.16,16 arc(33.92,16.05) 33.71,16.19 33.4,16.5 arc(33.2,16.63) 32.95,16.68 27.86,16.68 arc(26.89,16.49) 26.07,15.94 25.1,14.98 arc(24.28,14.43) 23.31,14.23 15.49,14.23 arc(15.39,14.25) 15.31,14.31 v1(15.1,14.51)
PC3: length 24
  Top Layer w0.178: v1(14.37,14.54) U11.18
  Bottom Layer w0.178: v1(14.37,14.54) 14.86,14.05 arc(15.06,13.91) 15.31,13.86 23.78,13.86 arc(24.56,14.02) 25.22,14.46 25.29,14.53 arc(25.95,14.97) 26.72,15.12 33.24,15.12 arc(33.48,15.17) 33.69,15.31 33.7,15.31 arc(33.9,15.45) 34.15,15.5 J1.28
PC4: length 23.9
  Top Layer w0.178: v1(14.37,9.43) U11.33
  Bottom Layer w0.178: J1.48 33.86,10.5 arc(33.76,10.48) 33.68,10.43 33.52,10.27 arc(33.43,10.21) 33.34,10.19 29.93,10.19 arc(29.83,10.21) 29.75,10.27 29.67,10.35 arc(29.59,10.4) 29.49,10.42 15.89,10.42 arc(15.4,10.32) 14.99,10.05 v1(14.37,9.43)
PC5: length 23.3
  Top Layer w0.178: v1(15.1,9.46) U11.34
  Bottom Layer w0.178: J1.50 36.16,9.91 15.56,9.91 v1(15.1,9.46)
PC6: length 11.5
  Top Layer w0.178: U11.63 26.67,5.77 arc(26.88,5.64) 27.12,5.59 28.37,5.59 arc(28.61,5.64) 28.82,5.77 29.09,6.05 arc(29.3,6.19) 29.54,6.23 33.78,6.23 arc(34.02,6.28) 34.23,6.42 34.37,6.56 arc(34.58,6.7) 34.82,6.75 J1.63
PC7: length 11.1
  Top Layer w0.178: J1.61 34.8,7.25 arc(34.56,7.2) 34.35,7.06 34.11,6.82 arc(33.9,6.68) 33.66,6.64 29.23,6.64 arc(28.98,6.59) 28.78,6.45 28.53,6.2 arc(28.32,6.06) 28.08,6.02 27.4,6.02 arc(27.16,6.06) 26.95,6.2 26.15,7
PC8: length 27.5
  Top Layer w0.178: U11.65 25.87,7.99 arc(25.66,8.13) 25.42,8.17 25.04,8.17 arc(24.8,8.13) 24.59,7.99 22.25,5.65 arc(21.84,5.38) 21.36,5.28 18.52,5.28 arc(18.43,5.3) 18.34,5.35 v1(18.15,5.55) ; 1.84,4.11 2.45,4.11 arc(2.55,4.09) 2.63,4.04 2.76,3.9 arc(2.85,3.84) 2.94,3.83 CARD1.7 4.42,3.83 arc(4.66,3.87) 4.87,4.01 4.9,4.05 arc(5.04,4.25) 5.09,4.49 5.09,5.09 arc(5.11,5.19) 5.16,5.27 5.33,5.43 arc(5.41,5.49) 5.5,5.51 v1(6.11,5.51)
  Inner1 w0.178: v1(6.11,5.51) 18.11,5.51 v1(18.15,5.55)
PC9: length 28.5
  Top Layer w0.178: v1(5.62,4.97) 5.62,3.63 arc(5.57,3.39) 5.44,3.18 5.15,2.9 arc(4.95,2.76) 4.7,2.71 1.84,2.71 ; v1(19.75,5.77) 21.34,5.77 arc(21.83,5.87) 22.24,6.15 24.28,8.18 arc(24.69,8.46) 25.18,8.56 25.48,8.56 arc(25.97,8.46) 26.38,8.18 U11.66
  Inner1 w0.178: v1(19.75,5.77) 19.32,5.35 arc(18.91,5.07) 18.42,4.97 v1(5.62,4.97)
PC10: length 33.1
  Top Layer w0.178: v1(15.91,7.64) 17.22,7.64 arc(17.71,7.55) 18.12,7.27 18.75,6.64 arc(19.16,6.37) 19.65,6.27 21.29,6.27 arc(21.78,6.37) 22.19,6.64 U11.78 ; v1(6.13,7.64) 6.13,8.77 arc(6.04,9.25) 5.76,9.66 5.34,10.09 arc(4.93,10.36) 4.44,10.46 2.91,10.46 arc(2.81,10.44) 2.73,10.39 2.63,10.28 arc(2.55,10.23) 2.45,10.21 1.84,10.21
  Inner1 w0.178: v1(6.13,7.64) 15.9,7.64 v1(15.91,7.64)
PC11: length 32.7
  Top Layer w0.178: v1(17.25,8.2) 17.63,8.2 arc(17.87,8.16) 18.08,8.02 18.82,7.28 arc(19.23,7) 19.72,6.9 21.22,6.9 arc(21.7,7) 22.12,7.28 U11.79 ; v1(5.6,7.11) 5.6,8.03 arc(5.5,8.51) 5.23,8.93 5.21,8.94 arc(4.8,9.22) 4.31,9.32 3.2,9.32 arc(2.95,9.27) 2.75,9.13 2.74,9.12 arc(2.53,8.98) 2.29,8.94 1.84,8.94
  Inner1 w0.178: v1(17.25,8.2) 17.25,8.19 16.45,7.39 arc(16.14,7.18) 15.77,7.11 v1(5.6,7.11)
PC12: length 28.2
  Top Layer w0.178: v1(20.33,7.41) 21.02,7.41 arc(21.5,7.51) 21.92,7.78 U11.80 ; CARD1.5 3.86,6.04 v1(5.62,6.04)
  Inner1 w0.178: v1(20.33,7.41) 19.33,6.41 arc(18.92,6.14) 18.44,6.04 v1(5.62,6.04)
PC13: length 21.3
  Top Layer w0.178: v1(2.17,15.04) LED2.1 ; v1(16.23,20.46) U11.7
  Inner1 w0.178: v1(2.17,15.04) 2.17,18.71 arc(2.27,19.19) 2.54,19.6 3.03,20.09 arc(3.44,20.36) 3.93,20.46 v1(16.23,20.46)
PD0: length 10.3
  Top Layer w0.178: J1.41 34.69,12.25 arc(34.45,12.3) 34.24,12.44 30.75,15.92 arc(30.55,16.06) 30.31,16.11 29.8,16.11 arc(29.56,16.06) 29.35,15.92 U11.81
PD1: length 10.6
  Top Layer w0.178: J1.39 34.94,12.75 34.94,12.75 34.43,12.75 30.83,16.34 arc(30.63,16.48) 30.38,16.53 29.51,16.53 arc(29.27,16.48) 29.06,16.34 U11.82
PD2: length 30.7
  Top Layer w0.178: v1(19.72,7.73) 19.74,7.73 U11.83 ; 1.84,7.67 2.16,7.67 arc(2.41,7.71) 2.61,7.85 2.8,8.04 arc(3.01,8.18) 3.25,8.22 4.4,8.22 arc(4.64,8.18) 4.85,8.04 4.88,8 arc(5.02,7.8) 5.07,7.56 5.07,6.99 arc(5.09,6.89) 5.14,6.81 5.31,6.65 arc(5.39,6.59) 5.49,6.57 v1(6.13,6.57)
  Inner1 w0.178: v1(19.72,7.73) 18.93,6.95 arc(18.52,6.67) 18.03,6.57 v1(6.13,6.57)
PD3: length 11.1
  Top Layer w0.178: J1.37 34.72,13.25 arc(34.48,13.3) 34.28,13.44 30.97,16.74 arc(30.77,16.88) 30.52,16.92 28.49,16.92 arc(28.25,16.88) 28.04,16.74 U11.84
PD4: length 11.5
  Top Layer w0.178: U11.85 27.71,17.12 arc(27.92,17.25) 28.16,17.3 30.62,17.3 arc(30.87,17.25) 31.07,17.12 34.24,13.95 arc(34.45,13.81) 34.69,13.76 36.49,13.76 J1.35
PD5: length 11.6
  Top Layer w0.178: U11.86 27.42,17.53 arc(27.62,17.67) 27.87,17.71 31.61,17.71 arc(31.85,17.67) 32.06,17.53 34.65,14.94 arc(34.86,14.8) 35.1,14.75 J1.31
PD6: length 11.9
  Top Layer w0.178: 26.15,16.97 27.13,17.95 arc(27.34,18.09) 27.58,18.14 31.65,18.14 arc(31.9,18.09) 32.1,17.95 34.62,15.44 arc(34.82,15.3) 35.06,15.25 J1.29
PD7: length 12.3
  Top Layer w0.178: J1.27 35.04,15.75 arc(34.79,15.8) 34.59,15.94 32.16,18.36 arc(31.96,18.5) 31.71,18.55 27.29,18.55 arc(27.04,18.5) 26.84,18.36 U11.88
PD8: length 15.2
  Top Layer w0.178: v1(23.86,2.93) U11.55
  Bottom Layer w0.178: J1.66 34.47,6 arc(33.99,5.9) 33.58,5.63 33.22,5.27 arc(32.8,4.99) 32.32,4.9 28.89,4.9 arc(27.91,4.7) 27.09,4.15 25.35,2.42 arc(25.15,2.28) 24.91,2.23 24.82,2.23 arc(24.58,2.28) 24.37,2.42 v1(23.86,2.93)
PD9: length 14.7
  Top Layer w0.178: v1(24.59,2.9) U11.56
  Bottom Layer w0.178: J1.64 34.4,6.5 arc(33.91,6.4) 33.5,6.13 33.07,5.7 arc(32.66,5.42) 32.17,5.33 28.07,5.33 arc(27.1,5.13) 26.27,4.58 v1(24.59,2.9)
PD10: length 14.1
  Top Layer w0.178: v1(24.57,3.64) U11.57
  Bottom Layer w0.178: J1.62 34.63,7 arc(33.86,6.85) 33.2,6.41 33.11,6.32 arc(32.45,5.88) 31.67,5.72 27.71,5.72 arc(26.73,5.53) 25.91,4.98 v1(24.57,3.64)
PD11: length 13.1
  Top Layer w0.178: U11.58 25.25,3.66 arc(25.45,3.52) 25.7,3.47 33.69,3.47 arc(33.79,3.49) 33.87,3.55 34,3.68 arc(34.08,3.73) 34.18,3.75 J1.75
PD12: length 12.9
  Top Layer w0.178: J1.71 30.72,4.75 arc(30.48,4.7) 30.28,4.56 29.81,4.1 arc(29.6,3.96) 29.36,3.91 25.97,3.91 arc(25.72,3.96) 25.52,4.1 U11.59
PD13: length 12.6
  Top Layer w0.178: J1.69 35.06,5.25 arc(34.96,5.23) 34.88,5.18 34.85,5.15 arc(34.77,5.09) 34.67,5.07 30.45,5.07 arc(30.21,5.02) 30,4.89 29.61,4.49 arc(29.4,4.36) 29.16,4.31 26.28,4.31 arc(26.04,4.36) 25.83,4.49 U11.60
PD14: length 12.2
  Top Layer w0.178: J1.67 34.85,5.75 arc(34.75,5.73) 34.67,5.68 34.53,5.53 arc(34.44,5.48) 34.35,5.46 30.16,5.46 arc(29.92,5.41) 29.71,5.27 29.37,4.93 arc(29.17,4.79) 28.92,4.75 26.55,4.75 arc(26.3,4.79) 26.1,4.93 U11.61
PD15: length 11.9
  Top Layer w0.178: J1.65 34.93,6.25 arc(34.68,6.2) 34.48,6.06 34.43,6.02 arc(34.23,5.88) 33.99,5.83 29.82,5.83 arc(29.58,5.78) 29.37,5.65 29.04,5.31 arc(28.83,5.17) 28.59,5.13 26.87,5.13 arc(26.63,5.17) 26.42,5.31 25.45,6.29
PE3: length 17.7
  Top Layer w0.178: v1(19.9,20.32) U11.2
  Bottom Layer w0.178: v1(19.9,20.32) 20.15,20.07 arc(20.23,20.02) 20.33,20 J1.10
PE6: length 19.2
  Top Layer w0.178: v1(18.84,19.26) U11.5
  Bottom Layer w0.178: J1.20 35.35,17.5 arc(34.87,17.6) 34.46,17.87 34.26,18.07 arc(33.85,18.34) 33.36,18.44 20.19,18.44 arc(19.7,18.54) 19.29,18.81 v1(18.84,19.26)
PE9: length 21.7
  Top Layer w0.178: v1(16.84,7.08) 15.83,6.07 U11.40
  Bottom Layer w0.178: J1.56 36.25,8.5 32.06,8.5 arc(31.97,8.48) 31.88,8.42 31.71,8.25 arc(31.63,8.19) 31.53,8.17 29.07,8.17 arc(28.98,8.19) 28.89,8.25 28.72,8.42 arc(28.64,8.48) 28.54,8.5 19.08,8.5 arc(18.31,8.34) 17.65,7.9 16.84,7.1 v1(16.84,7.08)
$1N16193: length 2
  Top Layer w0.178: v1(17.67,24.94) R15.2
  Bottom Layer w0.178: U12.2 18.49,24.94 v1(17.67,24.94)
$1N16597: length 4.6
  Top Layer w0.178: 8.43,3.64 8.43,3.19 8.83,2.79 R18.2
  Bottom Layer w0.178: U14.1 6.87,3.35 7.09,3.56 8.23,3.56 v1(8.39,3.73) 8.08,4.05 U13.2
$1N16719: length 1.3
  Top Layer w0.178: R19.2 LED1.2
$1N16929: length 1.3
  Top Layer w0.178: LED2.2 R20.1
$1N18159: length 2.2
  Top Layer w0.254: C21.1 18.34,1.11 arc(18.28,1.2) 18.26,1.29 18.26,1.75 arc(18.31,1.99) 18.45,2.2 U11.49
$1N18195: length 4.3
  Top Layer w0.178: C22.1 30.83,9.62 arc(30.75,9.56) 30.65,9.55 30.07,9.55 arc(29.98,9.56) 29.9,9.62 U11.73
$1N18531: length 5.5
  Top Layer w0.178: U11.6 17.15,20.25 arc(16.87,20.66) 16.78,21.14 16.78,22.9 arc(16.83,23.14) 16.96,23.35 17.1,23.48 arc(17.31,23.62) 17.55,23.67 C23.2

## Copper pours and planes (outline as drawn; the poured copper is in the pictures)
3V3 on Top Layer: 23.15,22.23 23.55,21.83 28.74,21.83 29,22.09 29,23.82 28.74,24.08 23.28,24.08 23.15,23.94
3V3 on Top Layer: 23.21,23.18 22.64,22.61 22.64,22.02 23.41,21.25 23.86,21.25 24.86,22.25 23.93,23.18
3V3 on Top Layer: 0.47,7.04 0.48,7.09 0.5,7.13 0.54,7.16 0.59,7.17 2.57,7.17 2.62,7.16 2.66,7.13 2.68,7.09 2.69,7.04 2.69,6.12 2.68,6.07 2.66,6.03 2.62,6 2.57,5.99 0.59,5.99 0.54,6 0.5,6.03 0.48,6.07 0.47,6.12
3V3 on Inner1: 0.39,7.18 0.4,7.22 0.42,7.26 0.46,7.28 0.5,7.28 2.62,7.28 2.66,7.28 2.69,7.26 2.72,7.22 2.72,7.18 2.72,6.06 2.72,6.02 2.69,5.99 2.66,5.97 2.62,5.96 0.5,5.96 0.46,5.97 0.42,5.99 0.4,6.02 0.39,6.06
+5V on Top Layer: 29.55,24.99 29.55,24.32 29.6,24.27 30.75,24.27 30.85,24.17 30.85,23.43 30.75,23.33 29.59,23.33 29.54,23.28 29.54,22.45 29.61,22.38 33.2,22.38 34.08,23.27 34.08,23.84 34.06,23.86 31.37,23.86 31.3,23.93 31.3,24.71 31.3,24.71 31.3,24.8 31.11,24.99 29.55,24.99
GND on Top Layer: -1.51,27.22 36.34,27.22 36.34,-1.48 -1.51,-1.48
GND on Bottom Layer: -2.4,28.11 40.78,28.11 40.78,-2.62 -2.4,-2.62
GND on Inner1: -2.15,27.99 39.76,27.99 39.76,-1.48 -2.15,-1.48
GND on Inner2: -2.4,28.11 40.78,28.11 40.78,-3.51 -2.4,-3.51
M2_IN_+5V on Top Layer: 30.96,26.15 30.96,24.97 31.12,24.81 32.44,24.81 32.59,24.66 32.59,24.31 32.71,24.19 33.38,24.19 33.42,24.14 34.19,24.14 34.32,24.28 34.32,25.93 33.99,26.27 31.08,26.27
M2_IN_+5V on Bottom Layer: 34.67,20.41 33.79,20.41 33.56,20.63 31.09,23.18 31.09,24.4 31.09,26.35 31.18,26.43 33.73,26.43 34.67,25.49 34.67,20.41

## Text on the board
Bottom Silkscreen Layer: 1 | 0 | BOOT1 | JLCJLCJLCJLC | BOOT0 | Design By | Ver 1.0 | SongJiaCheng
Top Silkscreen Layer: REST
